# EAGLE board DAC STM32 Board v6.1 - AD5391 (EAGLE 9.6.1), part 1 of 2
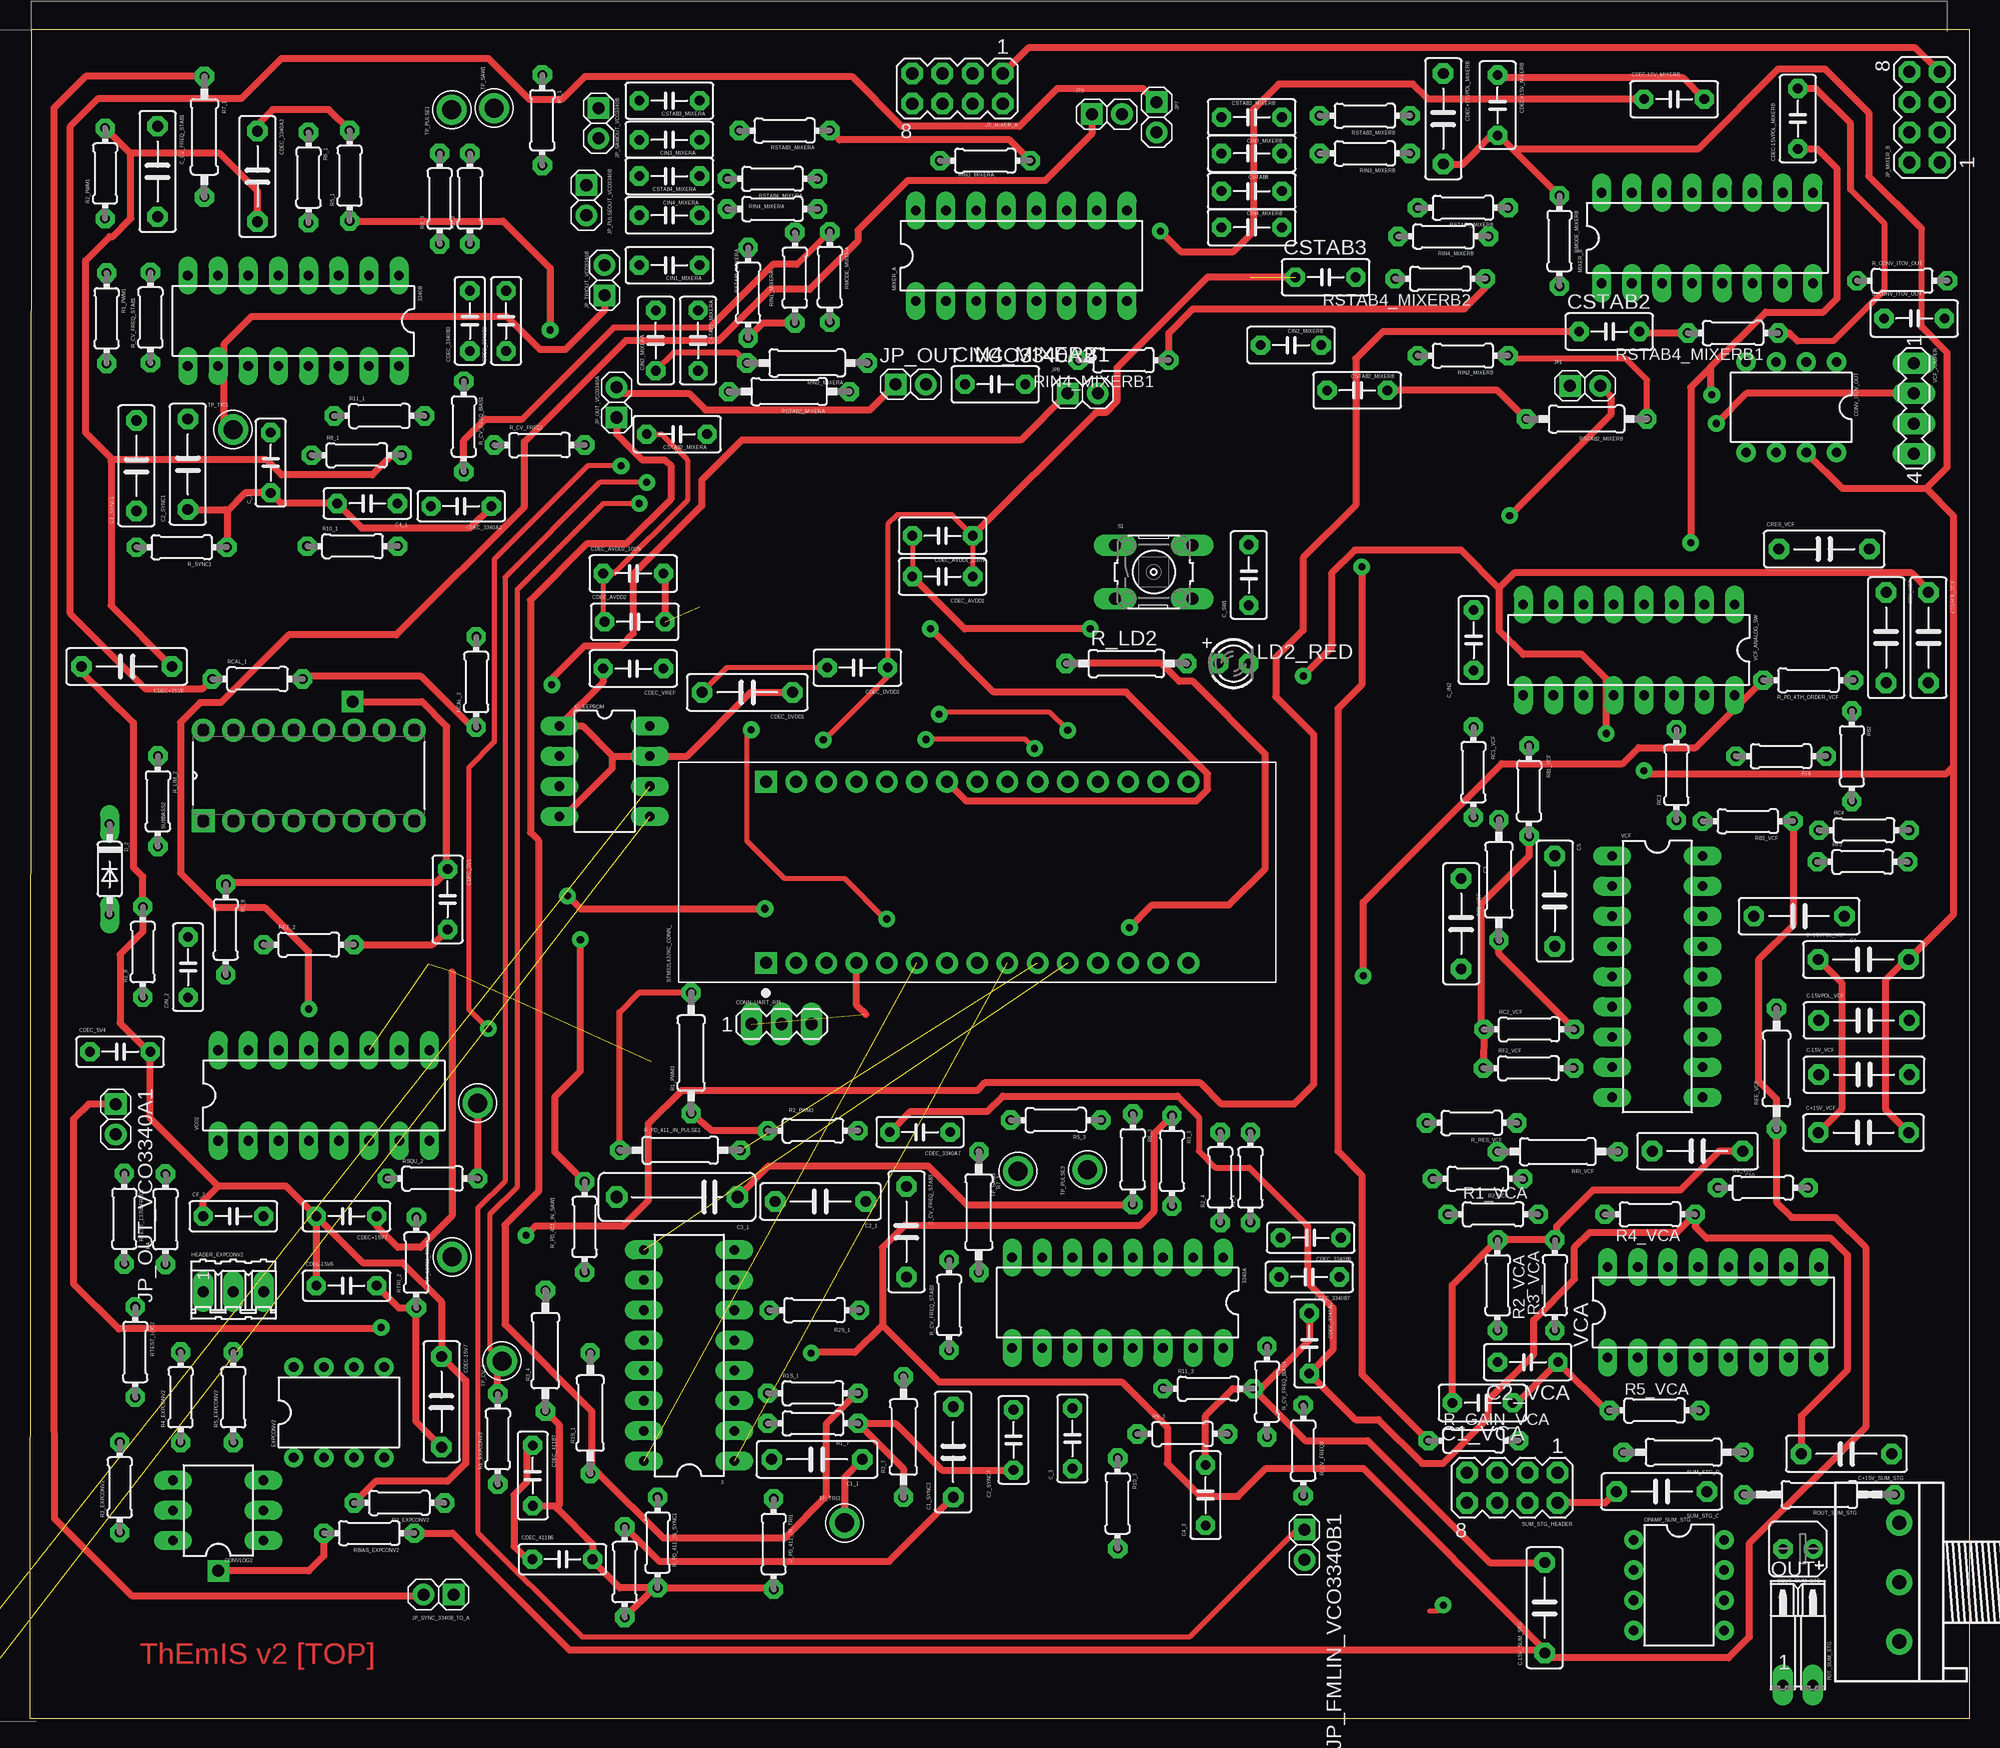
[diagram p5: board, top side]
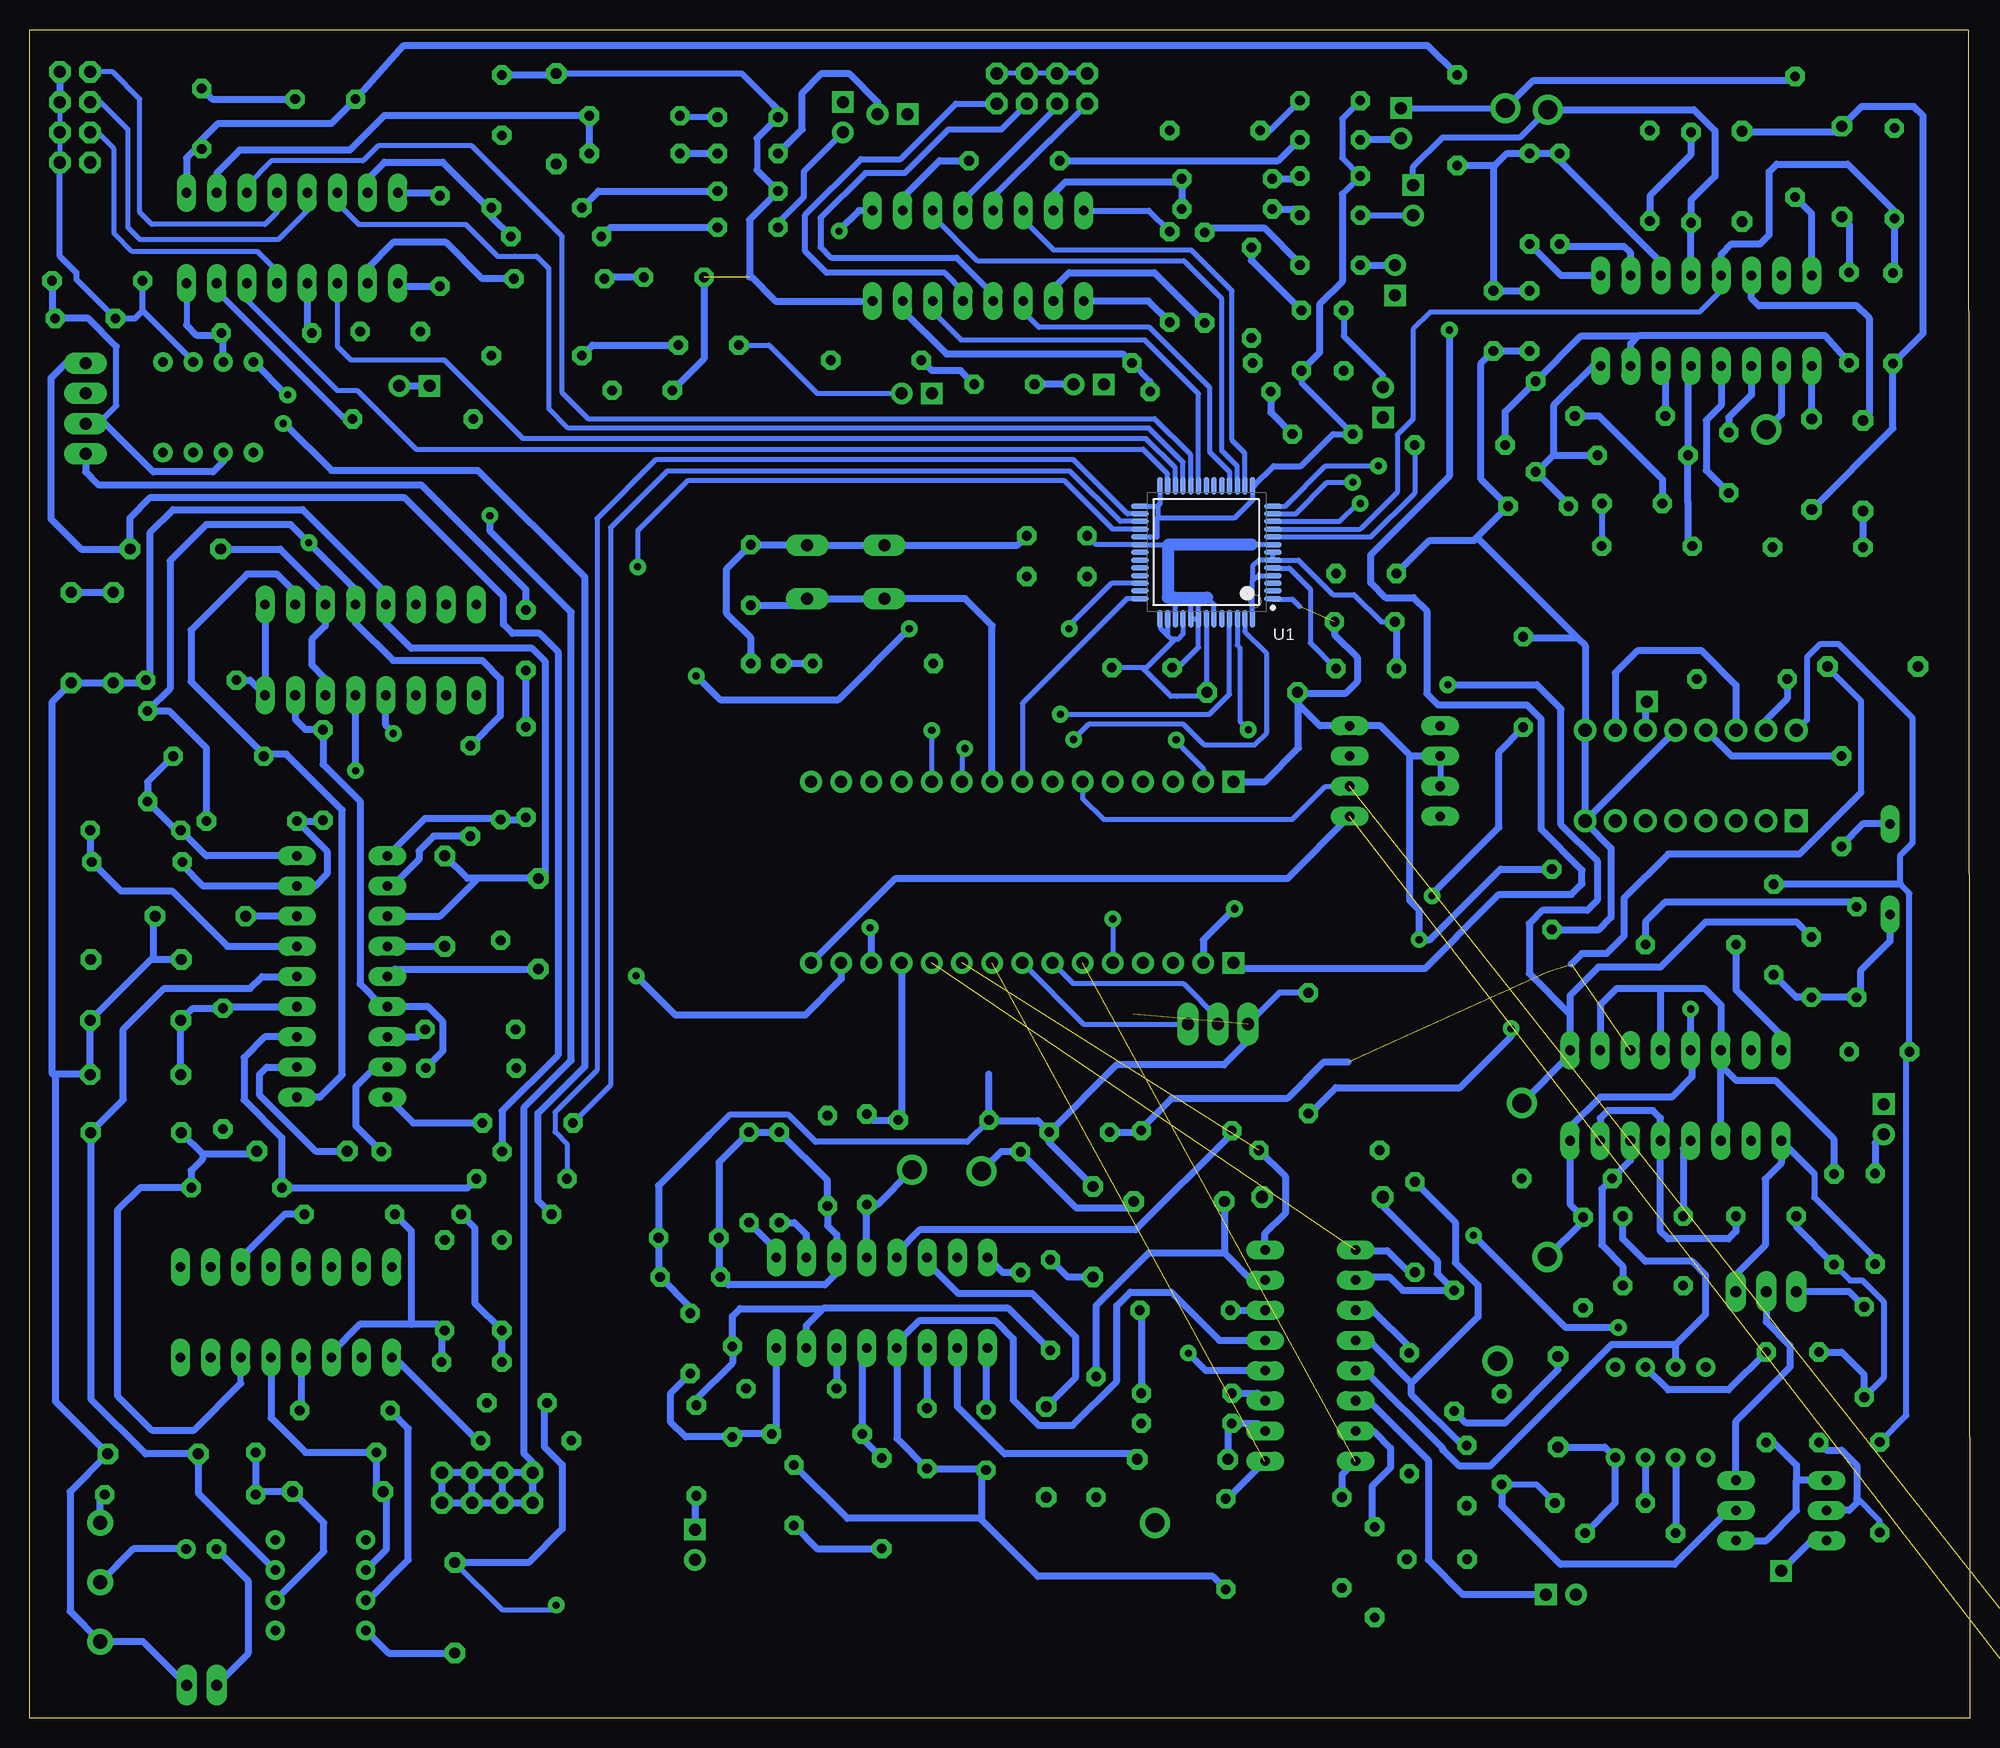
[diagram p6: board, bottom side, seen from below]

Size 163.32 x 142.11 mm. Coordinates in mm from the lower left corner, seen from the top.
Outline: 0,0 163.32,0 163.32,142.11 0.13,142.11 0,0
Copper layers (1*16): Top 0.035mm / dielectric 1.5mm / Bottom 0.035mm
Design rules "ENSEA_2019 *": minimum track width 0.4mm, minimum drill 0.6mm, track to track 0.4mm, track to pad 0.4mm, pad to pad 0.4mm, via to via 0.4mm, smd to smd 0.4mm, copper to edge 1mm, drill to drill 0.4mm, minimum pad ring 0.4mm, minimum via ring 0.4mm, stop-mask expansion 4mil, vias tented up to drill 0mil, thermal gap 0.4mm

## Footprints (pad centres in the part's own frame; a part is rotated, then mirrored left to right if it is on the bottom)
DIL16 = drill 0.813 long: 1 -8.89,-3.81; 2 -6.35,-3.81; 3 -3.81,-3.81; 4 -1.27,-3.81; 5 1.27,-3.81; 6 3.81,-3.81; 7 6.35,-3.81; 8 8.89,-3.81; 9 8.89,3.81; 10 6.35,3.81; 11 3.81,3.81; 12 1.27,3.81; 13 -1.27,3.81; 14 -3.81,3.81; 15 -6.35,3.81; 16 -8.89,3.81
C075-032X103 = drill 0.914 octagon: 1 -3.81,0; 2 3.81,0
C050-030X075 = drill 0.813 octagon: 1 -2.54,0; 2 2.54,0
C050-025X075 = drill 0.813 octagon: 1 -2.54,0; 2 2.54,0
C102-043X133 = drill 1.016 octagon: 1 -5.08,0; 2 5.08,0
MA03-1 = drill 1.016 long: 1 -2.54,0; 2 0,0; 3 2.54,0
DIL08 = drill 0.813 pad 1.27: 1 -3.81,-3.81; 2 -1.27,-3.81; 3 1.27,-3.81; 4 3.81,-3.81; 5 3.81,3.81; 6 1.27,3.81; 7 -1.27,3.81; 8 -3.81,3.81
DIL06 = drill 0.813 long: 1 -2.54,-3.81; 2 0,-3.81; 3 2.54,-3.81; 4 2.54,3.81; 5 0,3.81; 6 -2.54,3.81
B45181A = drill 0.813 pad 1.6: + -1.27,0 | drill 0.813 pad 1.6 octagon: - 1.27,0
DO35-7 = drill 0.813 long: A 3.81,0; C -3.81,0
03P = drill 0.914 long: 1 -2.54,0; 2 0,0; 3 2.54,0
DIL8 = drill 0.813 long: 1 -3.81,-3.81; 2 -1.27,-3.81; 3 1.27,-3.81; 4 3.81,-3.81; 5 3.81,3.81; 6 1.27,3.81; 7 -1.27,3.81; 8 -3.81,3.81
HDR2X1 = drill 1.016 square: 1 0,0 | drill 1.016: 2 2.54,0
MA04-2 = drill 1.016 octagon: 1 -3.81,-1.27; 2 -3.81,1.27; 3 -1.27,-1.27; 4 -1.27,1.27; 5 1.27,-1.27; 6 1.27,1.27; 7 3.81,-1.27; 8 3.81,1.27
LED3MM = drill 0.813 pad 1.676 octagon: A -1.27,0; K 1.27,0
02PA = drill 0.914 long: 1 -1.27,0; 2 1.27,0
3RP/1610N = drill 1.2 pad 2.184: 1 -5,0; 2 0,0; 3 5,0
0204/7 = drill 0.813 octagon: 1 -3.81,0; 2 3.81,0
0207/10 = drill 0.813 octagon: 1 -5.08,0; 2 5.08,0
0207/12 = drill 0.813 octagon: 1 -6.35,0; 2 6.35,0
B3F-10XX = drill 1.016 long: 1 -3.251,2.261; 2 3.251,2.261; 3 -3.251,-2.261; 4 3.251,-2.261
MODULE_NUCLEO-F303K8 = drill 1.02 square: 3.1 -7.62,17.78; 4.1 7.62,17.78 | drill 1.02: 3.2 -7.62,15.24; 3.3 -7.62,12.7; 3.4 -7.62,10.16; 3.5 -7.62,7.62; 3.6 -7.62,5.08; 3.7 -7.62,2.54; 3.8 -7.62,0; 3.9 -7.62,-2.54; 3.10 -7.62,-5.08; 3.11 -7.62,-7.62; 3.12 -7.62,-10.16; 3.13 -7.62,-12.7; 3.14 -7.62,-15.24; 3.15 -7.62,-17.78; 4.2 7.62,15.24; 4.3 7.62,12.7; 4.4 7.62,10.16; 4.5 7.62,7.62; 4.6 7.62,5.08; 4.7 7.62,2.54; 4.8 7.62,0; 4.9 7.62,-2.54; 4.10 7.62,-5.08; 4.11 7.62,-7.62; 4.12 7.62,-10.16; 4.13 7.62,-12.7; 4.14 7.62,-15.24; 4.15 7.62,-17.78
DIP254P762X420-16 = drill 1.118 square: 1 -7.62,17.78 | drill 1.118: 2 -7.62,15.24; 3 -7.62,12.7; 4 -7.62,10.16; 5 -7.62,7.62; 6 -7.62,5.08; 7 -7.62,2.54; 8 -7.62,0; 9 0,0; 10 0,2.54; 11 0,5.08; 12 0,7.62; 13 0,10.16; 14 0,12.7; 15 0,15.24; 16 0,17.78
TESTPOINT_63 = drill 1.6 pad 2.54: P$1 0,0
ANALOG_DEVICES_AD5391BSTZ-3_0 = smd 1.45 x 0.45: 1 -5.6,3.9; 2 -5.6,3.25; 3 -5.6,2.6; 4 -5.6,1.95; 5 -5.6,1.3; 6 -5.6,0.65; 7 -5.6,0; 8 -5.6,-0.65; 9 -5.6,-1.3; 10 -5.6,-1.95; 11 -5.6,-2.6; 12 -5.6,-3.25; 13 -5.6,-3.9; 27 5.6,-3.9; 28 5.6,-3.25; 29 5.6,-2.6; 30 5.6,-1.95; 31 5.6,-1.3; 32 5.6,-0.65; 33 5.6,0; 34 5.6,0.65; 35 5.6,1.3; 36 5.6,1.95; 37 5.6,2.6; 38 5.6,3.25; 39 5.6,3.9 | smd 0.45 x 1.45: 14 -3.9,-5.6; 15 -3.25,-5.6; 16 -2.6,-5.6; 17 -1.95,-5.6; 18 -1.3,-5.6; 19 -0.65,-5.6; 20 0,-5.6; 21 0.65,-5.6; 22 1.3,-5.6; 23 1.95,-5.6; 24 2.6,-5.6; 25 3.25,-5.6; 26 3.9,-5.6; 40 3.9,5.6; 41 3.25,5.6; 42 2.6,5.6; 43 1.95,5.6; 44 1.3,5.6; 45 0.65,5.6; 46 0,5.6; 47 -0.65,5.6; 48 -1.3,5.6; 49 -1.95,5.6; 50 -2.6,5.6; 51 -3.25,5.6; 52 -3.9,5.6
DIL18 = drill 0.813 long: 1 -10.16,-3.81; 2 -7.62,-3.81; 3 -5.08,-3.81; 4 -2.54,-3.81; 5 0,-3.81; 6 2.54,-3.81; 7 5.08,-3.81; 8 7.62,-3.81; 9 10.16,-3.81; 10 10.16,3.81; 11 7.62,3.81; 12 5.08,3.81; 13 2.54,3.81; 14 0,3.81; 15 -2.54,3.81; 16 -5.08,3.81; 17 -7.62,3.81; 18 -10.16,3.81
MA04-1 = drill 1.016 long: 1 -3.81,0; 2 -1.27,0; 3 1.27,0; 4 3.81,0

## Placement (x,y rotation side)
3  ADG411N  [DIL16]  55.52,30.54 90 top
3340A  CEM3340  [DIL16]  91.59,34.98 180 top
3340B  CEM3340  [DIL16]  22.2,117.61 180 top
C1_1  470n  [C075-032X103]  66.27,21.79 180 top
C1_SYNC1  1n  [C075-032X103]  8.99,105.42 90 top
C1_SYNC3  1n  [C075-032X103]  77.74,22.41 90 top
C1_VCA  4.7u  [C050-030X075]  122.3,26.54 180 top
C2_1  470n  [C075-032X103]  66.57,43.49 180 top
C2_SYNC1  100n  [C075-032X103]  13.31,105.54 90 top
C2_SYNC3  100n  [C050-025X075]  82.82,23.42 90 top
C2_VCA  4.7u  [C050-030X075]  126.11,29.97 180 top
C3  300p  [C075-032X103]  120.5,66.87 270 top
C3_1  470n  [C102-043X133]  54.5,43.87 180 top
C4  300p  [C075-032X103]  148.95,67.5 180 top
C4_1  10n  [C050-025X075]  28.42,102.24 180 top
C4_3  10n  [C050-025X075]  98.99,18.78 90 top
C5  300p  [C075-032X103]  128.38,68.77 270 top
C5V_VCF  100n  [C075-032X103]  156.28,90.95 270 top
C5VPOL_VCF  100n  [C075-032X103]  159.83,90.95 270 top
C10  300p  [C075-032X103]  140.39,47.73 180 top
C+15V_SUM_STG  100n  [C075-032X103]  152.94,22.25 180 top
C+15V_VCF  100n  [C075-032X103]  154.37,49.29 0 top
C+15VPOL_VCF  1u  [C075-032X103]  154.36,63.86 0 top
C-15V_SUM_STG  100n  [C075-032X103]  127.54,9.3 90 top
C-15V_VCF  100n  [C075-032X103]  154.41,54.17 0 top
C-15VPOL_VCF  1u  [C075-032X103]  154.41,58.74 0 top
C_1  1n  [C050-025X075]  20.29,105.67 90 top
C_3  1n  [C050-025X075]  87.78,23.55 90 top
C_CONV_ITOV_OUT  1p  [C050-030X075]  158.65,117.81 0 top
C_CV_FREQ_STAB1  10n  [C075-032X103]  10.77,130.18 270 top
C_CV_FREQ_STAB3  10n  [C075-032X103]  73.81,40.95 270 top
C_IN2  470n  [C050-025X075]  121.56,90.74 90 top
C_SW1  100n  [C050-030X075]  102.63,96.22 90 top
CDEC+15V6  100n  [C075-032X103]  8.16,88.52 180 top
CDEC+15V7  100n  [C050-025X075]  26.67,42.25 180 top
CDEC+15V_MIXERB  100n  [C050-030X075]  123.57,135.76 270 top
CDEC+15VPOL_MIXERB  100n  [C075-032X103]  119,134.62 270 top
CDEC-15V6  100n  [C050-025X075]  26.67,36.41 0 top
CDEC-15V7  100n  [C075-032X103]  34.67,26.63 270 top
CDEC-15V_MIXERB  100n  [C050-030X075]  138.43,136.27 0 top
CDEC-15VPOL_MIXERB  100n  [C050-030X075]  148.84,134.62 90 top
CDEC_5V1  100n  [C050-025X075]  35.18,68.92 270 top
CDEC_5V4  100n  [C050-025X075]  7.62,56.1 0 top
CDEC_411B6  100n  [C050-025X075]  44.85,13.39 0 top
CDEC_411B7  10u  [C050-025X075]  42.35,20.43 270 top
CDEC_3340A2  100n  [C050-025X075]  36.33,102.01 180 top
CDEC_3340A3  10u  [C075-032X103]  19.17,129.77 270 top
CDEC_3340A6  100n  [C050-025X075]  107.72,31.55 270 top
CDEC_3340A7  10u  [C050-025X075]  74.95,49.33 180 top
CDEC_3340B2  100n  [C050-025X075]  40.1,117.61 90 top
CDEC_3340B3  10u  [C050-025X075]  37.06,117.61 90 top
CDEC_3340B6  100n  [C050-025X075]  107.84,40.44 180 top
CDEC_3340B7  10u  [C050-025X075]  107.72,37.14 180 top
CDEC_AVDD1  10u  [C050-030X075]  76.84,96.09 180 top
CDEC_AVDD1_100N  100n  [C050-030X075]  76.84,99.52 180 top
CDEC_AVDD2  10u  [C050-030X075]  50.94,92.28 0 top
CDEC_AVDD2_100N  100n  [C050-030X075]  50.81,96.35 0 top
CDEC_DVDD1  100n  [C075-032X103]  60.41,86.34 180 top
CDEC_DVDD2  100n  [C050-030X075]  69.68,88.42 180 top
CDEC_VREF  100n  [C050-030X075]  50.81,88.35 180 top
CF_2  100nF  [C050-025X075]  17.14,42.25 0 top
CIN1_MIXERA  470n  [C050-030X075]  53.85,122.3 0 top
CIN2_MIXERA  470n  [C050-030X075]  52.71,115.95 270 top
CIN2_MIXERB  470n  [C050-030X075]  106.17,115.57 0 top
CIN3_MIXERA  470n  [C050-030X075]  53.85,132.84 0 top
CIN3_MIXERB  470n  [C050-030X075]  102.87,131.7 0 top
CIN4_MIXERA  470n  [C050-030X075]  53.85,126.49 0 top
CIN4_MIXERB  470n  [C050-030X075]  102.87,125.48 0 top
CIN4_MIXERB1  470n  [C050-030X075]  81.28,112.27 0 top
CIN_2  470n  [C050-025X075]  13.33,63.21 90 top
CONN_UART_RPI  [MA03-1]  63.29,58.43 0 top
CONV_ITOV_OUT  NE5534AN  [DIL08]  148.29,110.34 180 top
CONVLOG2  BC857BS  [DIL06]  15.87,17.49 90 top
COUT_SUM_STG  22u  [B45181A]  148.87,14.25 180 top
CRES_VCF  1u  [C075-032X103]  151.06,98.41 0 top
CSTAB1_MIXERA  560p  [C050-030X075]  56.26,115.95 90 top
CSTAB2  560p  [C050-030X075]  132.97,116.71 0 top
CSTAB2_MIXERA  560p  [C050-030X075]  54.48,108.08 0 top
CSTAB2_MIXERB  560p  [C050-030X075]  111.76,111.76 0 top
CSTAB3  560p  [C050-030X075]  109.09,121.28 0 top
CSTAB3_MIXERA  560p  [C050-030X075]  53.85,136.14 0 top
CSTAB3_MIXERB  560p  [C050-030X075]  102.87,134.75 0 top
CSTAB4_MIXERA  560p  [C050-030X075]  53.85,129.79 0 top
CSTAB8  560p  [C050-030X075]  102.87,128.52 0 top
D_2  1N4148DO35-7  [DO35-7]  6.73,71.46 270 top
EXPCONV2  TL081  [DIL08]  26.03,25.74 0 top
HEADER_EXPCONV2  [03P]  17.14,35.9 0 top
IC_EEPROM  24C04AP  [DIL8]  48.4,79.71 270 top
JP1  JUMPER  [HDR2X1]  129.67,112.14 0 top
JP7  JUMPER  [HDR2X1]  94.87,136.02 270 top
JP8  JUMPER  [HDR2X1]  87.38,111.51 0 top
JP9  JUMPER  [HDR2X1]  89.41,135 0 top
JP_FMLIN_VCO3340B1  JUMPER  [HDR2X1]  107.31,15.88 270 top
JP_MIXER_A  [MA04-2]  78.1,137.16 180 top
JP_MIXER_B  [MA04-2]  159.51,134.75 90 top
JP_OUT_VCO3340A  JUMPER  [HDR2X1]  49.4,109.47 90 top
JP_OUT_VCO3340A1  JUMPER  [HDR2X1]  7.24,51.69 270 top
JP_OUT_VCO3340A2  JUMPER  [HDR2X1]  72.9,112.27 0 top
JP_PULSEOUT_VCO3340B  JUMPER  [HDR2X1]  46.86,129.03 270 top
JP_SAWOUT_VCO3340B  JUMPER  [HDR2X1]  47.88,135.51 270 top
JP_SYNC_3340B_TO_A  JUMPER  [HDR2X1]  35.69,10.41 180 top
JP_TRIOUT_VCO3340B  JUMPER  [HDR2X1]  48.39,119.76 90 top
LD2_RED  [LED3MM]  101.35,88.77 0 top
MIXER_A  SSM2164_MULTI  [DIL16]  83.48,123.09 0 top
MIXER_B  SSM2164_MULTI  [DIL16]  141.22,124.59 0 top
OPAMP_SUM_STG  NE5534AN  [DIL08]  138.84,11.21 270 top
OUT  [02PA]  148.84,2.79 0 top
POT_SUM_STG  100kB  [3RP/1610N]  157.38,11.46 90 top
R1_3  30k  [0204/7]  37.06,127.89 90 top
R1_4  30k  [0204/7]  102.76,45.52 90 top
R1_7  100k  [0204/7]  65.93,24.82 180 top
R1_8  100k  [0204/7]  16.51,66.38 270 top
R1_EXPCONV2  330  [0204/7]  39.41,23.49 90 top
R1_PWM1  68k  [0204/7]  6.47,117.83 270 top
R1_PWM3  68k  [0207/10]  55.68,55.99 90 top
R1_VCA  10k  [0204/7]  123.19,42.42 0 top
R1_VCF  10k  [0204/7]  145.91,44.64 0 top
R1S_1  1k  [0204/7]  65.93,27.36 0 top
R2_3  5.6k  [0204/7]  34.52,127.89 90 top
R2_4  5.6k  [0204/7]  100.22,45.52 90 top
R2_7  100k  [0207/10]  73.55,23.68 90 top
R2_8  100k  [0204/7]  9.52,64.48 90 top
R2_EXPCONV2  10  [0204/7]  31.11,18.12 180 top
R2_PWM1  330k  [0204/7]  6.34,130.02 90 top
R2_PWM3  330k  [0204/7]  65.93,49.46 0 top
R2_VCA  10k  [0204/7]  123.57,36.45 270 top
R2_VCF  100k  [0204/7]  121.9,45.41 180 top
R2S_1  1k  [0204/7]  66.06,34.35 180 top
R3_1  820  [0204/7]  43.15,134.5 270 top
R3_3  820  [0204/7]  96.16,46.92 270 top
R3_4  100k  [0207/10]  43.41,30.93 90 top
R3_EXPCONV2  260  [0204/7]  7.58,19.43 90 top
R3_VCA  10k  [0204/7]  128.4,36.45 90 top
R3S_1  1k  [0207/10]  47.19,25.67 90 top
R4_EXPCONV2  10  [0204/7]  12.7,27.01 90 top
R4_VCA  10k  [0204/7]  136.4,42.42 180 top
R5_1  10k  [0204/7]  26.93,129.82 90 top
R5_3  10k  [0204/7]  86.38,50.35 180 top
R5_EXPCONV2  110  [0204/7]  17.14,27.01 90 top
R5_VCA  100k  [0204/7]  136.78,25.91 0 top
R6_1  33k  [0204/7]  23.47,129.67 270 top
R6_3  33k  [0204/7]  92.86,47.05 270 top
R7_1  5.6k  [0207/10]  14.7,133.1 270 top
R7_3  5.6k  [0207/10]  79.9,42.6 270 top
R8_1  1.5M  [0204/7]  27.53,106.3 0 top
R8_3  1.5M  [0204/7]  97.05,23.93 0 top
R10_1  470  [0204/7]  27.17,98.65 0 top
R10_3  470  [0204/7]  91.59,18.09 270 top
R11_1  1.8k  [0204/7]  29.44,109.61 0 top
R11_3  1.8k  [0204/7]  99.21,27.74 0 top
R_CONV_ITOV_OUT  33K  [0204/7]  157.63,120.99 0 top
R_CV_FREQ1  68k  [0204/7]  42.92,107.16 0 top
R_CV_FREQ3  68k  [0204/7]  107.21,22.54 270 top
R_CV_FREQ_BIAS1  270k  [0204/7]  36.55,108.72 270 top
R_CV_FREQ_BIAS3  270k  [0204/7]  104.16,27.49 270 top
R_CV_FREQ_STAB1  470  [0204/7]  10.17,117.88 90 top
R_CV_FREQ_STAB3  470  [0204/7]  77.4,34.78 90 top
R_GAIN_VCA  47k  [0204/7]  121.54,23.37 0 top
R_LD2  330  [0207/10]  92.33,88.77 0 top
R_LIM_2  1k  [0204/7]  10.79,77.18 270 top
R_PD_4TH_ORDER_VCF  100k  [0204/7]  149.73,87.38 180 top
R_PD_411_IN_PULSE1  100k  [0207/10]  54.76,47.81 0 top
R_PD_411_IN_SAW1  100k  [0204/7]  46.72,41.35 90 top
R_PD_411_IN_SYNC1  100k  [0204/7]  52.85,14.79 270 top
R_PD_411_IN_TRI1  100k  [0204/7]  62.63,14.66 270 top
R_PU_DSA  1k  [0207/10]  -9.91,-11.05 0 top  (outside the outline)
R_PU_SCL  1k  [0207/10]  -9.91,-6.48 0 top  (outside the outline)
R_RES_VCF  100k  [0204/7]  121.39,50.11 180 top
R_SYNC1  470k  [0204/7]  12.8,98.56 180 top
R_SYNC3  470k  [0204/7]  50.09,12.3 90 top
RA_2  4.7k  [0204/7]  11.43,42 90 top
RB1_VCF  220k  [0204/7]  126.22,78.05 270 top
RB2  220k  [0204/7]  153.4,80.97 270 top
RB3_VCF  220k  [0204/7]  144.64,75.51 180 top
RBIAS_EXPCONV2  47k  [0204/7]  28.57,15.58 180 top
RC1_VCF  91k  [0204/7]  121.54,79.63 270 top
RC2_VCF  91k  [0204/7]  126.22,57.98 0 top
RC3  91k  [0204/7]  138.62,79.39 90 top
RC4  91k  [0204/7]  154.41,74.74 0 top
RCAL_1  47k  [0204/7]  19.18,87.47 0 top
RCAL_2  100k  [0204/7]  37.59,87.21 90 top
REE_2  27k  [0204/7]  23.49,65.11 0 top
REE_VCF  1.5k  [0207/10]  147.05,54.68 90 top
RF1_VCF  100k  [0207/10]  123.68,70.55 90 top
RF2_VCF  100k  [0204/7]  126.17,54.72 0 top
RF3  100k  [0204/7]  154.29,72.08 0 top
RF4  100k  [0204/7]  147.43,80.97 180 top
RIN1_MIXERA  27k  [0204/7]  64.41,121.24 90 top
RIN2_MIXERA  27k  [0207/10]  65.45,114.07 180 top
RIN2_MIXERB  27k  [0204/7]  120.65,114.68 180 top
RIN3_MIXERA  27k  [0204/7]  80.43,131.09 180 top
RIN3_MIXERB  27k  [0204/7]  112.39,131.7 180 top
RIN4_MIXERA  27k  [0204/7]  62.53,127.02 180 top
RIN4_MIXERB  27k  [0204/7]  119,124.71 180 top
RIN4_MIXERB1  27k  [0204/7]  92.07,114.3 180 top
RMODE_MIXERA  8.2k  [0204/7]  67.35,121.31 270 top
RMODE_MIXERB  8.2k  [0204/7]  128.78,124.33 270 top
ROUT_SUM_STG  470  [0207/12]  150.65,18.82 180 top
RRI_VCF  51k  [0207/10]  128.63,47.69 180 top
RSQU_2  10k  [0204/7]  33.91,45.43 0 top
RSTAB1_MIXERA  470  [0204/7]  60.48,119.97 90 top
RSTAB2_MIXERA  470  [0207/10]  63.92,111.66 180 top
RSTAB2_MIXERB  470  [0207/10]  131.06,109.35 180 top
RSTAB3_MIXERA  470  [0204/7]  63.54,133.63 180 top
RSTAB3_MIXERB  470  [0204/7]  112.39,134.87 180 top
RSTAB4_MIXERA  470  [0204/7]  62.53,129.56 180 top
RSTAB4_MIXERB  470  [0204/7]  120.65,127.13 180 top
RSTAB4_MIXERB1  470  [0204/7]  143.38,116.59 180 top
RSTAB4_MIXERB2  470  [0204/7]  118.74,121.16 180 top
RTEST_13700FREQ2  27k  [0204/7]  7.96,42.04 270 top
RTEST_LOG2  1k  [0204/7]  8.89,30.82 270 top
RTRI_2  12k  [0204/7]  32.55,38.35 90 top
S1  [B3F-10XX]  94.62,96.47 0 top
STM32L432KC_CONN_  NUCLEO-F303K8  [MODULE_NUCLEO-F303K8]  79.77,71.2 90 top
SUBBASS2  HEF4027BP  [DIP254P762X420-16]  32.38,83.15 90 top
SUM_STG_C  560p  [C075-032X103]  137.39,19.08 180 top
SUM_STG_HEADER  [MA04-2]  124.81,19.4 180 top
SUM_STG_R  27k  [0207/10]  139.22,22.38 180 top
TP_13700_SQU2  [TESTPOINT_63]  37.72,51.78 90 top
TP_13700_TRI2  [TESTPOINT_63]  35.56,38.83 90 top
TP_CV_2  [TESTPOINT_63]  39.75,30.06 90 top
TP_PULSE1  [TESTPOINT_63]  35.53,135.39 90 top
TP_PULSE3  [TESTPOINT_63]  89.05,46.16 90 top
TP_SAW1  [TESTPOINT_63]  39.09,135.51 90 top
TP_SAW3  [TESTPOINT_63]  83.21,46.03 90 top
TP_TRI1  [TESTPOINT_63]  17.12,108.46 0 top
TP_TRI3  [TESTPOINT_63]  68.6,16.44 0 top
U1  ANALOG_DEVICES_AD5391BSTZ-3ANALOG_DEVICES_AD5391BSTZ-3_0_0  [ANALOG_DEVICES_AD5391BSTZ-3_0]  64.27,98.12 180 bottom
VCA  LM13700N  [DIL16]  141.73,34.16 0 top
VCF  AS3320  [DIL18]  137.02,62.42 270 top
VCF_ANALOG_SW  DG413DJN  [DIL16]  134.62,89.92 180 top
VCF_JUMPER  [MA04-1]  158.62,110.24 270 top
VCO2  LM13700N  [DIL16]  24.76,52.41 0 top